# EAGLE design Control Board1 (EAGLE 6.5.0)
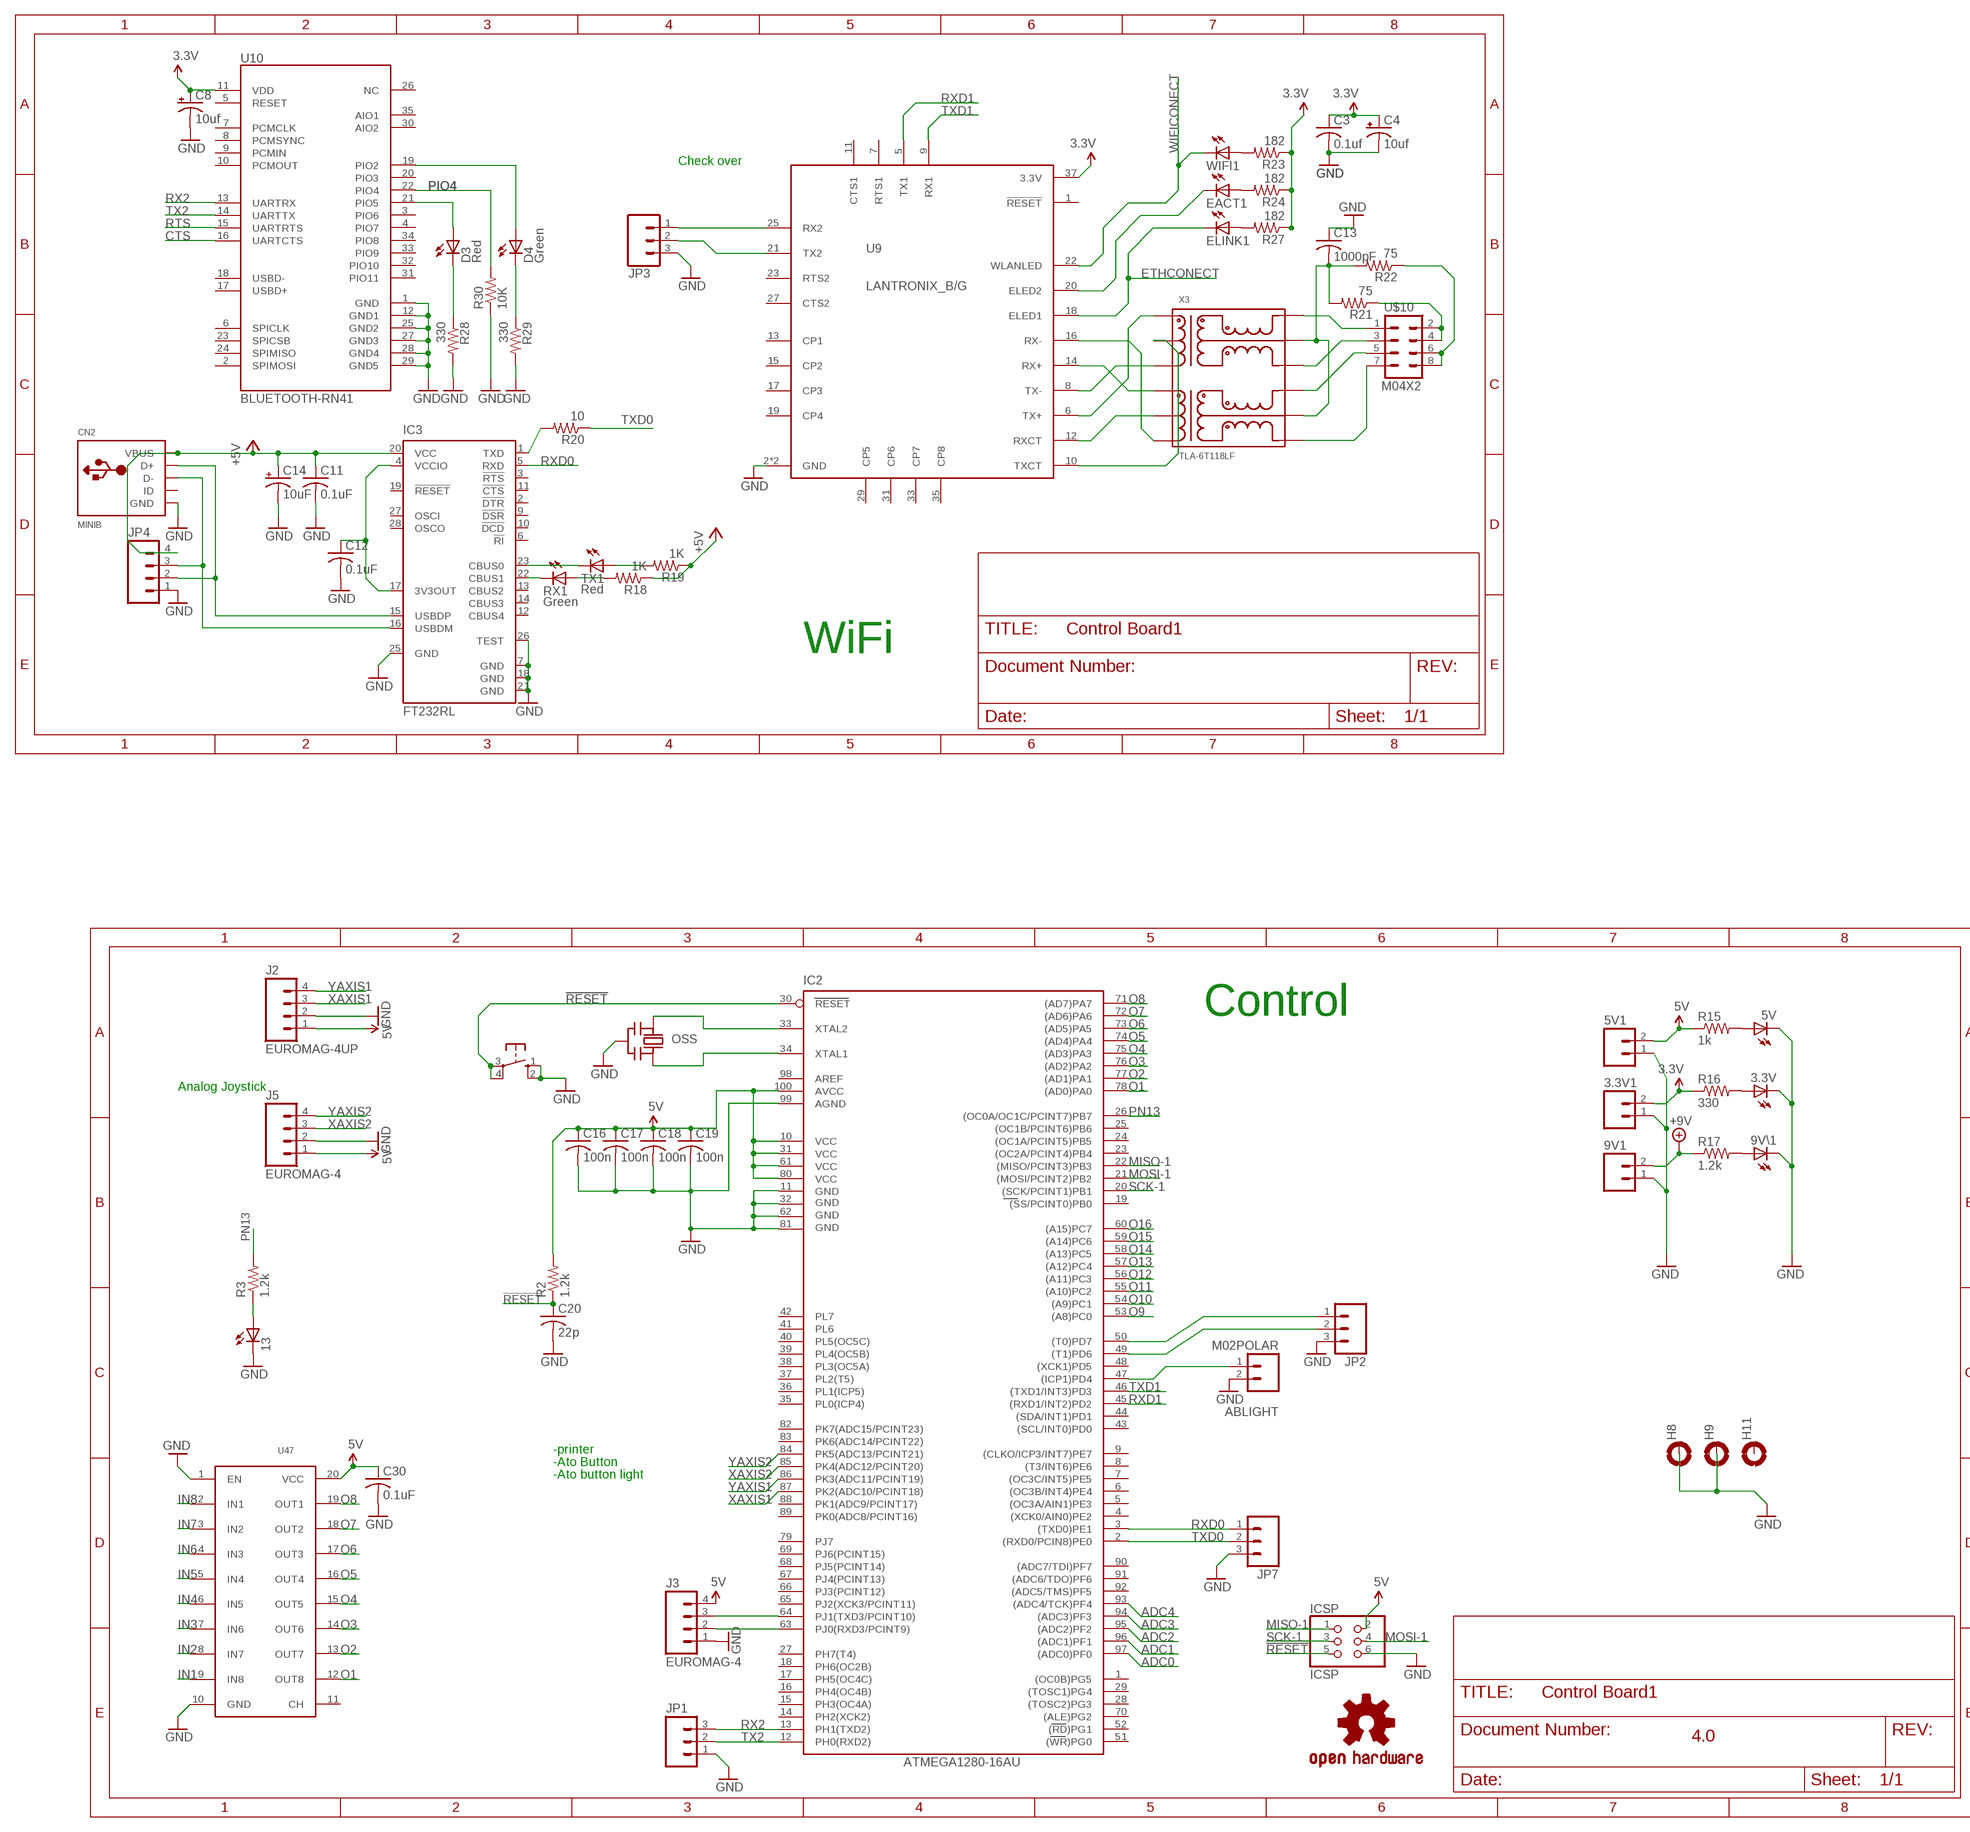
[diagram p0: schematic, sheet 1, part 1 of 2]
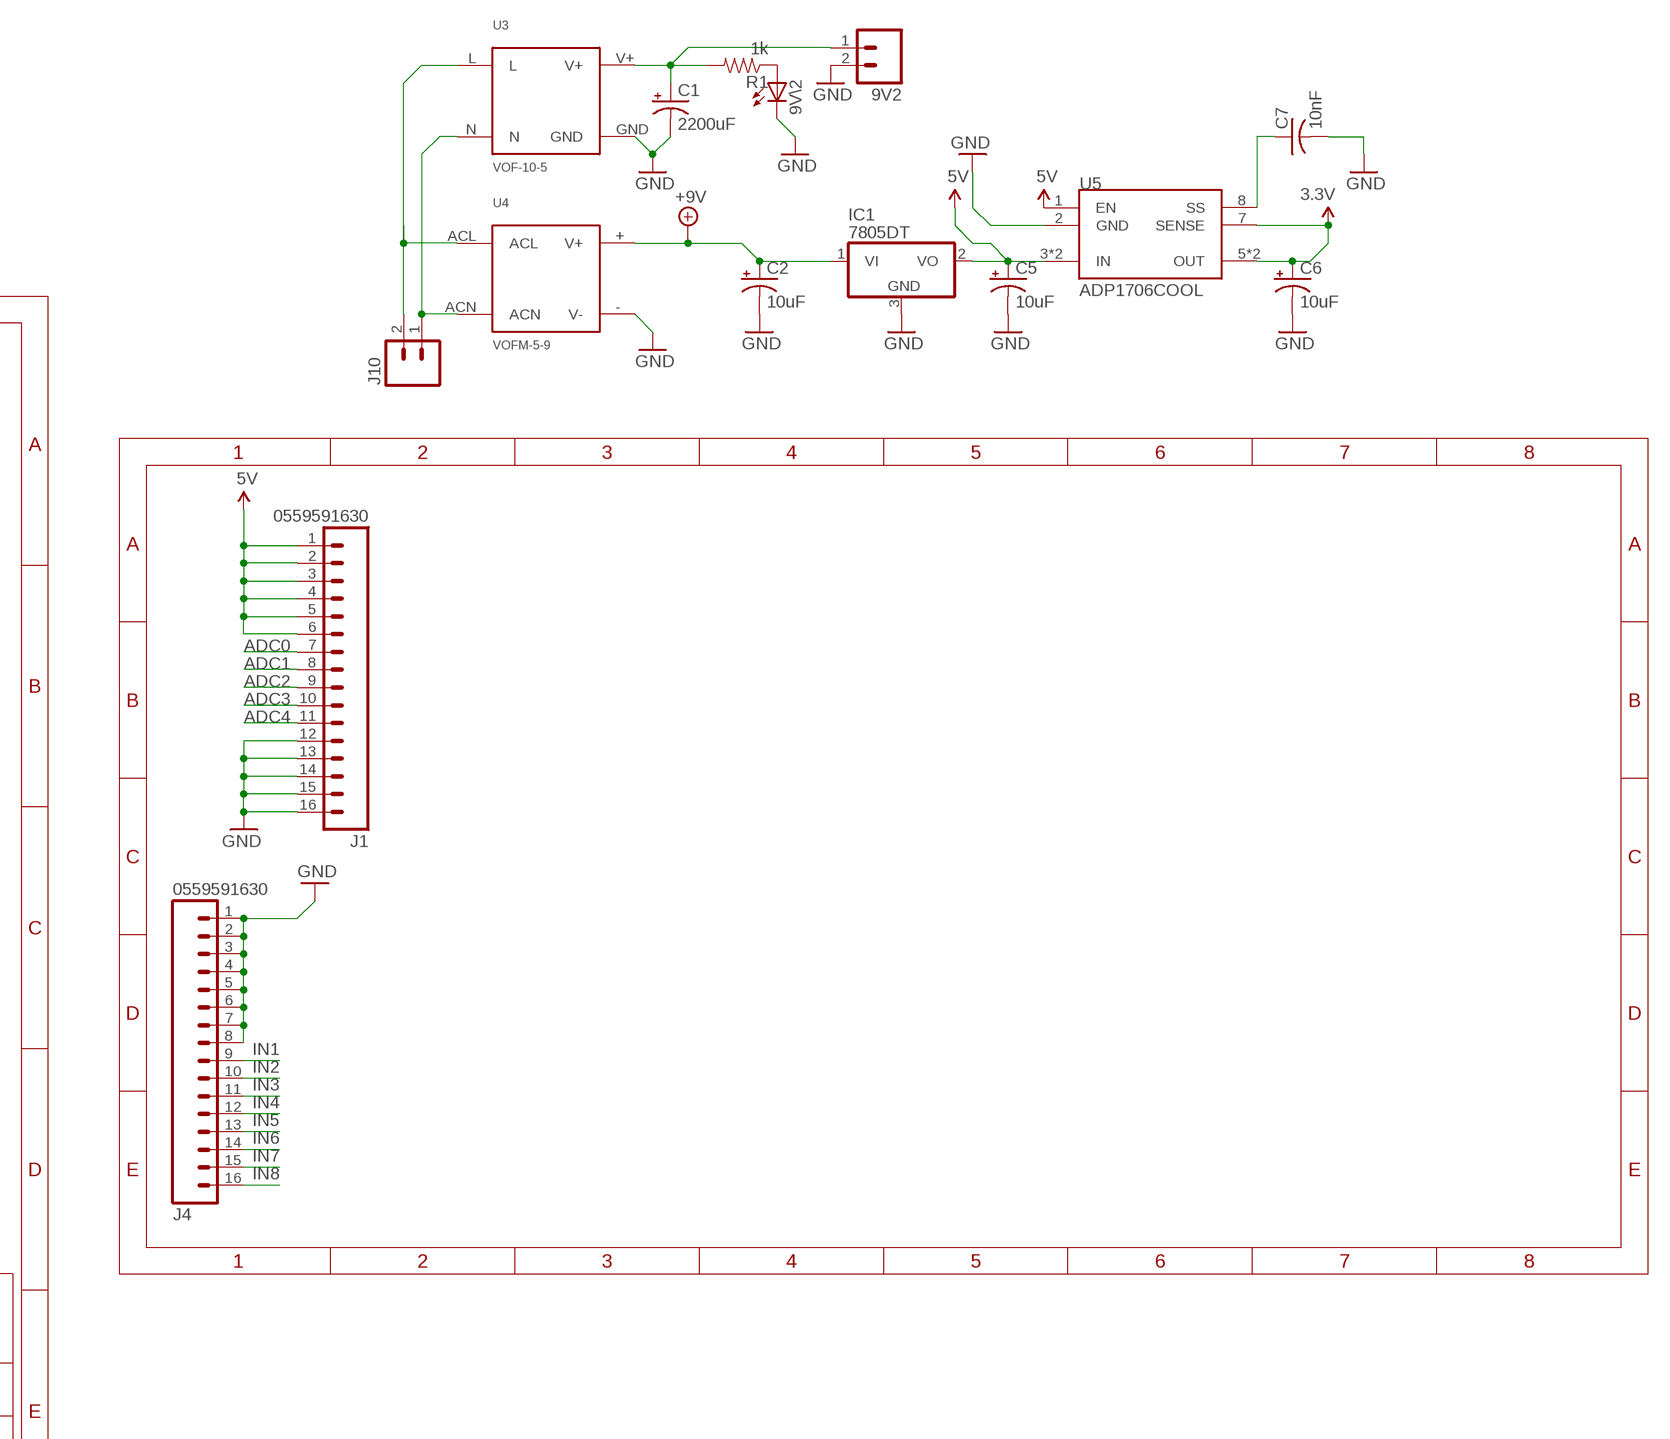
[diagram p1: schematic, sheet 1, part 2 of 2]

## Parts
3.3V  LED-FKIT-1206  [FKIT-LED-1206]
3.3V1  EUROMAG-290DEG  [M2]
5V  LED-FKIT-1206  [FKIT-LED-1206]
5V1  EUROMAG-290DEG  [M2]
9V1  EUROMAG-290DEG  [M2]
9V2  EUROMAG-290DEG  [M2]
9V\1  LED-FKIT-1206  [FKIT-LED-1206]
9V\2  LED-FKIT-1206  [FKIT-LED-1206]
13  LEDCHIP-LED0805  [CHIP-LED0805]
ABLIGHT  M02POLAR  [MOLEX-1X2]
C1  2200uF  CPOL-USE10-20  [EB20D]
C2  10uF  CPOL-USCT3528  [CT3528]
C3  0.1uf  C-USC0805K  [C0805K]
C4  10uf  CAP_POL3528  [EIA3528]
C5  10uF  CPOL-USCT3528  [CT3528]
C6  10uF  CPOL-USCT3528  [CT3528]
C7  10nF  C-USC0805  [C0805]
C8  10uf  CAP_POL3528  [EIA3528]
C11  0.1uF  C-USC0805K  [C0805K]
C12  0.1uF  C-USC0805K  [C0805K]
C13  1000pF  C-USC1812  [C1812]
C14  10uF  CAP_POL3528-KIT  [EIA3528-KIT]
C16  100n  C-USC0805  [C0805]
C17  100n  C-USC0805  [C0805]
C18  100n  C-USC0805  [C0805]
C19  100n  C-USC0805  [C0805]
C20  22p  C-USC0805  [C0805]
C30  0.1uF  C-USC0805  [C0805]
CN2  MINIB  USBMINIB  [USB-MINIB]
D3  Red  LEDCHIP-LED0805  [CHIP-LED0805]
D4  Green  LEDCHIP-LED0805  [CHIP-LED0805]
EACT1  LEDCHIP-LED0805  [CHIP-LED0805]
ELINK1  LEDCHIP-LED0805  [CHIP-LED0805]
H8  MOUNT-PAD-ROUND2.8  [2,8-PAD]
H9  MOUNT-PAD-ROUND2.8  [2,8-PAD]
H11  MOUNT-PAD-ROUND2.8  [2,8-PAD]
IC1  7805DT  [TO252]
IC2  ATMEGA1280-16AU  [TQFP100]
IC3  FT232RL  [SSOP28]
ICSP  ICSP  PINHD-2X3  [2X03]
J1  0559591630  [0559591630]
J2  EUROMAG-4UP  [M4-90]
J3  EUROMAG-4  [M4]
J4  0559591630  [0559591630]
J5  EUROMAG-4  [M4]
J10  EUROMAG-290DEG  [M2]
JP1  M03POLAR  [MOLEX-1X3]
JP2  M03POLAR  [MOLEX-1X3]
JP3  M03POLAR  [MOLEX-1X3]
JP4  M04LOCK  [1X04_LOCK]
JP7  M03LOCK  [1X03_LOCK]
OSS  CERMOSCILL-AWCSR  [AWCSR]
R1  1k  RESISTOR0805-RES  [0805]
R2  1.2k  RESISTOR0805-RES  [0805]
R3  1.2k  RESISTOR0805-RES  [0805]
R15  1k  RESISTOR0805-RES  [0805]
R16  330  RESISTOR0805-RES  [0805]
R17  1.2k  RESISTOR0805-RES  [0805]
R18  1K  R-US_R0805  [R0805@1]
R19  1K  R-US_R0805  [R0805@1]
R20  10  R-US_R0805  [R0805@1]
R21  75  R-US_R0805  [R0805@1]
R22  75  R-US_R0805  [R0805@1]
R23  182  R-US_R0805  [R0805@1]
R24  182  R-US_R0805  [R0805@1]
R27  182  R-US_R0805  [R0805@1]
R28  330  RESISTOR0805-RES  [0805]
R29  330  RESISTOR0805-RES  [0805]
R30  10K  RESISTOR0805-RES  [0805]
RX1  Green  LEDCHIP-LED0805  [CHIP-LED0805]
S1  10-XX  [B3F-10XX]
TX1  Red  LEDCHIP-LED0805  [CHIP-LED0805]
U3  VOF-10-5  VOF-10  [VOF-10]
U4  VOFM-5-9  VOFM-5  [VOFM-5]
U5  ADP1706COOL  [SO-8COOL]
U9  LANTRONIX_B/G  LANTRONIX_A/B  [LANA/BTH]
U10  BLUETOOTH-RN41  BLUETOOTH-RN41"  [RN41]
U47  MAX6818  [SSOP-20]
U$3  OSHW-LOGOL  [OSHW-LOGO-L]
U$10  M04X2  [2X4]
WIFI1  LEDCHIP-LED0805  [CHIP-LED0805]
X3  TLA-6T118LF  [SO-16MOD]

## Nets
3.3V: 3.3V1.2 C3.1 C4.A(+) C6.+ C8.A(+) R16.1 R23.1 R24.1 R27.1 U5.5(OUT) U5.6(OUT) U5.7(SENSE) U9.37(3.3V) U10.11(VDD)
5V: 5V1.2 C5.+ C16.1 C17.1 C18.1 C19.1 C30.1 IC1.2(VO) IC2.10(VCC) IC2.31(VCC1) IC2.61(VCC2) IC2.80(VCC3) IC2.100(AVCC) ICSP.2 J1.1 J1.2 J1.3 J1.4 J1.5 J1.6 J2.1 J3.4 J5.1 R2.2 R15.1 U5.1(EN) U5.3(IN) U5.4(IN) U47.20(VCC)
!RESET: C20.1 IC2.30(RESET) ICSP.5 R2.1 S1.3(P) S1.4(P1)
+5V: C11.1 C14.A(+) CN2.VBUS IC3.20(VCC) JP4.4 R18.1 R19.1
+9V: 9V1.2 C2.+ IC1.1(VI) R17.1 U4.+(V+)
ADC0: IC2.97((ADC0)PF0) J1.7
ADC1: IC2.96((ADC1)PF1) J1.8
ADC2: IC2.95((ADC2)PF2) J1.9
ADC3: IC2.94((ADC3)PF3) J1.10
ADC4: IC2.93((ADC4/TCK)PF4) J1.11
CTS: U10.16(UARTCTS)
D3: D3.C R28.1
D4: D4.C R29.1
ETHCONECT: ELINK1.C U9.18(ELED1)
GND: 3.3V1.1 3.3V.C 5V1.1 5V.C 9V1.1 9V2.2 9V\1.C 9V\2.C 13.C ABLIGHT.2 C1.- C2.- C3.2 C4.C(-) C5.- C6.- C7.2 C8.C(-) C11.2 C12.2 C13.1 C14.C(-) C16.2 C17.2 C18.2 C19.2 C20.2 C30.2 CN2.GND H8.B2,8(MOUNT) H9.B2,8(MOUNT) IC1.3(GND) IC2.11(GND) IC2.32(GND1) IC2.62(GND2) IC2.81(GND3) IC2.99(AGND) IC3.7(GND) IC3.18(GND) IC3.21(GND) IC3.25(GND) IC3.26(TEST) ICSP.6 J1.12 J1.13 J1.14 J1.15 J1.16 J2.2 J3.1 J4.1 J4.2 J4.3 J4.4 J4.5 J4.6 J4.7 J4.8 J5.2 JP1.1 JP2.3 JP3.3 JP4.1 JP7.3 OSS.2(GND) R28.2 R29.2 R30.1 S1.1(S) S1.2(S1) U3.GND U4.-(V-) U5.2(GND) U9.2(GND) U9.39(GND) U10.1(GND) U10.12(GND1) U10.25(GND2) U10.27(GND3) U10.28(GND4) U10.29(GND5) U47.1(EN) U47.10(GND)
IN1: J4.9 U47.9(IN8)
IN2: J4.10 U47.8(IN7)
IN3: J4.11 U47.7(IN6)
IN4: J4.12 U47.6(IN5)
IN5: J4.13 U47.5(IN4)
IN6: J4.14 U47.4(IN3)
IN7: J4.15 U47.3(IN2)
IN8: J4.16 U47.2(IN1)
MISO-1: IC2.22((MISO/PCINT3)PB3) ICSP.1
MOSI-1: IC2.21((MOSI/PCINT2)PB2) ICSP.4
N$1: C7.1 U5.8(SS)
N$2: 13.A R3.1
N$3: R21.1 U$10.2 U$10.4
N$4: R22.1 U$10.6 U$10.8
N$5: U$10.5 X3.11
N$6: IC2.34(XTAL1) OSS.3(OUT)
N$7: IC2.33(XTAL2) OSS.1(IN)
N$8: U$10.7 X3.9
N$9: 9V\2.A R1.1
N$10: IC2.63(PJ0(RXD3/PCINT9)) J3.2
N$11: IC2.64(PJ1(TXD3/PCINT10)) J3.3
N$12: ABLIGHT.1 IC2.47((ICP1)PD4)
N$13: IC2.50((T0)PD7) JP2.1
N$14: IC2.49((T1)PD6) JP2.2
N$15: JP3.1 U9.25(RX2)
N$16: JP3.2 U9.21(TX2)
N$22: 9V\1.A R17.2
N$23: 3.3V.A R16.2
N$24: 5V.A R15.2
N$25: J10.2 U3.L U4.ACL
N$27: J10.1 U3.N U4.ACN
N$28: 9V2.1 C1.+ R1.2 U3.V+
N$29: CN2.D+ IC3.15(USBDP) JP4.2
N$30: CN2.D- IC3.16(USBDM) JP4.3
N$31: IC3.23(CBUS0) TX1.C
N$32: IC3.22(CBUS1) RX1.C
N$33: R18.2 RX1.A
N$34: R19.2 TX1.A
N$35: IC3.1(TXD) R20.2
N$36: C12.1 IC3.4(VCCIO) IC3.17(3V3OUT)
N$37: U9.8(TX-) X3.3
N$38: U9.6(TX+) X3.1
N$39: U9.14(RX+) X3.6
N$42: U9.16(RX-) X3.8
N$44: U9.12(RXCT) X3.7
N$45: U9.10(TXCT) X3.2
N$50: U$10.3 X3.14
N$51: U$10.1 X3.16
N$52: C13.2 R21.2 R22.2 X3.10 X3.15
N$69: ELINK1.A R27.2
N$71: EACT1.A R24.2
N$72: R23.2 WIFI1.A
N$73: EACT1.C U9.20(ELED2)
N$74: D3.A U10.21(PIO5)
N$75: D4.A U10.19(PIO2)
O1: IC2.78((AD0)PA0) U47.12(OUT8)
O2: IC2.77((AD1)PA1) U47.13(OUT7)
O3: IC2.76((AD2)PA2) U47.14(OUT6)
O4: IC2.75((AD3)PA3) U47.15(OUT5)
O5: IC2.74((AD4)PA4) U47.16(OUT4)
O6: IC2.73((AD5)PA5) U47.17(OUT3)
O7: IC2.72((AD6)PA6) U47.18(OUT2)
O8: IC2.71((AD7)PA7) U47.19(OUT1)
O9: IC2.53((A8)PC0)
O10: IC2.54((A9)PC1)
O11: IC2.55((A10)PC2)
O12: IC2.56((A11)PC3)
O13: IC2.57((A12)PC4)
O14: IC2.58((A13)PC5)
O15: IC2.59((A14)PC6)
O16: IC2.60((A15)PC7)
PIO4: R30.2 U10.22(PIO4)
PN13: IC2.26((OC0A/OC1C/PCINT7)PB7) R3.2
RTS: U10.15(UARTRTS)
RX2: IC2.13(PH1(TXD2)) JP1.3 U10.13(UARTRX)
RXD0: IC2.3((TXD0)PE1) IC3.5(RXD) JP7.1
RXD1: IC2.45((RXD1/INT2)PD2) U9.5(TX1)
SCK-1: IC2.20((SCK/PCINT1)PB1) ICSP.3
TX2: IC2.12(PH0(RXD2)) JP1.2 U10.14(UARTTX)
TXD0: IC2.2((RXD0/PCIN8)PE0) JP7.2 R20.1
TXD1: IC2.46((TXD1/INT3)PD3) U9.9(RX1)
WIFICONECT: U9.22(WLANLED) WIFI1.C
XAXIS1: IC2.87(PK2(ADC10/PCINT18)) J2.3
XAXIS2: IC2.85(PK4(ADC12/PCINT20)) J5.3
YAXIS1: IC2.86(PK3(ADC11/PCINT19)) J2.4
YAXIS2: IC2.84(PK5(ADC13/PCINT21)) J5.4
Unconnected: CN2.ID H11.B2,8(MOUNT) IC2.1((OC0B)PG5) IC2.4((XCK0/AIN0)PE2) IC2.5((OC3A/AIN1)PE3) IC2.6((OC3B/INT4)PE4) IC2.7((OC3C/INT5)PE5) IC2.8((T3/INT6)PE6) IC2.9((CLKO/ICP3/INT7)PE7) IC2.14(PH2(XCK2)) IC2.15(PH3(OC4A)) IC2.16(PH4(OC4B)) IC2.17(PH5(OC4C)) IC2.18(PH6(OC2B)) IC2.19((SS/PCINT0)PB0) IC2.23((OC2A/PCINT4)PB4) IC2.24((OC1A/PCINT5)PB5) IC2.25((OC1B/PCINT6)PB6) IC2.27(PH7(T4)) IC2.28((TOSC2)PG3) IC2.29((TOSC1)PG4) IC2.35(PL0(ICP4)) IC2.36(PL1(ICP5)) IC2.37(PL2(T5)) IC2.38(PL3(OC5A)) IC2.39(PL4(OC5B)) IC2.40(PL5(OC5C)) IC2.41(PL6) IC2.42(PL7) IC2.43((SCL/INT0)PD0) IC2.44((SDA/INT1)PD1) IC2.48((XCK1)PD5) IC2.51((WR)PG0) IC2.52((RD)PG1) IC2.65(PJ2(XCK3/PCINT11)) IC2.66(PJ3(PCINT12)) IC2.67(PJ4(PCINT13)) IC2.68(PJ5(PCINT14)) IC2.69(PJ6(PCINT15)) IC2.70((ALE)PG2) IC2.79(PJ7) IC2.82(PK7(ADC15/PCINT23)) IC2.83(PK6(ADC14/PCINT22)) IC2.88(PK1(ADC9/PCINT17)) IC2.89(PK0(ADC8/PCINT16)) IC2.90((ADC7/TDI)PF7) IC2.91((ADC6/TDO)PF6) IC2.92((ADC5/TMS)PF5) IC2.98(AREF) IC3.2(!DTR) IC3.3(!RTS) IC3.6(!RI) IC3.9(!DSR) IC3.10(!DCD) IC3.11(!CTS) IC3.12(CBUS4) IC3.13(CBUS2) IC3.14(CBUS3) IC3.19(!RESET) IC3.27(OSCI) IC3.28(OSCO) U9.1(!RESET) U9.7(RTS1) U9.11(CTS1) U9.13(CP1) U9.15(CP2) U9.17(CP3) U9.19(CP4) U9.23(RTS2) U9.27(CTS2) U9.29(CP5) U9.31(CP6) U9.33(CP7) U9.35(CP8) U10.2(SPIMOSI) U10.3(PIO6) U10.4(PIO7) U10.5(RESET) U10.6(SPICLK) U10.7(PCMCLK) U10.8(PCMSYNC) U10.9(PCMIN) U10.10(PCMOUT) U10.17(USBD+) U10.18(USBD-) U10.20(PIO3) U10.23(SPICSB) U10.24(SPIMISO) U10.26(NC) U10.30(AIO2) U10.31(PIO11) U10.32(PIO10) U10.33(PIO9) U10.34(PIO8) U10.35(AIO1) U47.11(CH)

## Notes on the sheet
- Check over
- WiFi
- Control
- Analog Joystick
- -printer
- -Ato Button
- -Ato button light
- 4.0

## Library data of the parts
3.3V 5V 9V\1 9V\2 = SparkFun:LED: LEDs Standard schematic elements and footprints for 5mm, 3mm, 1206, and 0603 sized LEDs. 5mm - Spark Fun Electronics SKU : COM-00529 (and others)
3.3V1 5V1 9V1 9V2 J10 = NASA_LIB:EUROMAG-2
13 D3 D4 EACT1 ELINK1 RX1 TX1 WIFI1 = adafruit:LED: LED OSRAM: - CHIPLED LG R971, LG N971, LY N971, LG Q971, LY Q971, LO R971, LY R971 LH N974, LH R974 LS Q976, LO Q976, LY Q976 LO Q996 - Hyper CHIPLED LW Q18S LB Q993, LB Q99A, LB R99A - SideLED LS A670, LO A670, LY A670, LG A670, LP A670 LB A673, LV A673, LT A673, LW A673 LH A674 LY A675 LS A676, LA A676, LO A676, LY A676, LW A676 LS A679, LY A679, LG A679 - Hyper Micro SIDELED® LS Y876, LA Y876, LO Y876, LY Y876 LT Y87S - SmartLED LW L88C, LW L88S LB L89C, LB L89S, LG L890 LS L89K, LO L89K, LY L89K LS L896, LA L896, LO L896, LY L896 - TOPLED LS T670, LO T670, LY T670, LG T670, LP T670 LSG T670, LSP T670, LSY T670, LOP T670, LYG T670 LG T671, LOG T671, LSG T671 LB T673, LV T673, LT T673, LW T673 LH T674 LS T676, LA T676, LO T676, LY T676, LB T676, LH T676, LSB T676, LW T676 LB T67C, LV T67C, LT T67C, LS T67K, LO T67K, LY T67K, LW E67C LS E67B, LA E67B, LO E67B, LY E67B, LB E67C, LV E67C, LT E67C LW T67C LS T679, LY T679, LG T679 LS T770, LO T770, LY T770, LG T770, LP T770 LB T773, LV T773, LT T773, LW T773 LH T774 LS E675, LA E675, LY E675, LS T675 LS T776, LA T776, LO T776, LY T776, LB T776 LHGB T686 LT T68C, LB T68C - Hyper Mini TOPLED® LB M676 - Mini TOPLED Santana® LG M470 LS M47K, LO M47K, LY M47K Source: http://www.osram.convergy.de/
ABLIGHT = SparkFun-Connectors:M02: Standard 2-pin 0.1" header. Use with - straight break away headers ( PRT-00116) - right angle break away headers (PRT-00553) - swiss pins (PRT-00743) - machine pins (PRT-00117) - female headers (PRT-00115) Molex polarized connector foot print use with: PRT-08233 with associated crimp pins and housings. 2.54_SCREWTERM for use with PRT-10571. 3.5mm Screw Terminal footprints for PRT-08084 5mm Screw Terminal footprints for use with PRT-08433
C1 C2 C5 C6 = adafruit:CPOL-US: POLARIZED CAPACITOR, American symbol
C3 C7 C11-C13 C16-C20 C30 = adafruit:C-US: CAPACITOR, American symbol
C4 C8 C14 = SparkFun:CAP_POL: Capacitor Polarized These are standard SMD and PTH capacitors. Normally 10uF, 47uF, and 100uF in electrolytic and tantalum varieties. Always verify the external diameter of the through hole cap, it varies with capacity, voltage, and manufacturer. The EIA devices should be standard.
CN2 = adafruit:USB: USB Connectors USBMINIB - Surface Mount Female Mini-B USB Connector 4UConnector: 06564 By microbuilder.eu Thru-hole RA Female Mini-B USB Connector 4UConnector: 18732 By ladyada.net
H8 H9 H11 = holes:MOUNT-PAD-ROUND: MOUNTING PAD, round
IC1 = adafruit:78*: Positive VOLTAGE REGULATOR Added bigger pads to the TO-92 package
IC2 = atmel-2005:ATMEGA*: MICROCONTROLLER 64/128/256 Kbytes FLASH 4 Kbytes EEPROM 8 Kbytes SRAM 86 General Purpose I/O pins 12-channels16-bit PWM 4 x Serial USARTs 16-channels 10-bit A/D
IC3 = ftdichip:FT232R: Source: http://www.ftdichip.com/Documents/DataSheets/DS_FT232R_v104.pdf
ICSP = pinhead:PINHD-2X3: PIN HEADER
J1 J4 = NASA_LIB:0559591630
J2 J3 J5 = NASA_LIB:EUROMAG-4
JP1-JP3 JP7 = SparkFun:M03: Header 3 Standard 3-pin 0.1" header. Use with straight break away headers (SKU : PRT-00116), right angle break away headers (PRT-00553), swiss pins (PRT-00743), machine pins (PRT-00117), and female headers (PRT-00115). Molex polarized connector foot print use with SKU : PRT-08232 with associated crimp pins and housings.
JP4 = SparkFun:M04: Header 4 Standard 4-pin 0.1" header. Use with straight break away headers (SKU : PRT-00116), right angle break away headers (PRT-00553), swiss pins (PRT-00743), machine pins (PRT-00117), and female headers (PRT-00115). Molex polarized connector foot print use with SKU : PRT-08231 with associated crimp pins and housings. 1MM SMD Version SKU: PRT-10208
OSS = adafruit:CERMOSCILL: Ceramic oscillator with built in capacitors such as ZTT-12MHz http://www.ladyada.net/library/eagle
R1-R3 R15-R17 R28-R30 = SparkFun:RESISTOR: Resistor Basic schematic elements and footprints for 0603, 1206, and PTH resistors.
R18-R24 R27 = adafruit:R-US_: RESISTOR, American symbol
S1 = switch-omron:10-XX: OMRON SWITCH
U3 = NASA_LIB:VOF-10
U4 = NASA_LIB:VOFM-5
U5 = NASA_LIB:ADP1706
U9 = NASA_LIB:LANTRONIX_A/B
U10 = ScratchPad:BLUETOOTH-RN41
U47 = RJ's parts:MAX6818
U$3 = SparkFun:OSHW-LOGO: Open Source Hardware Logo This logo indicates the piece of hardware it is found on incorporates a OSHW license and/or adheres to the definition of open source hardware found here: http://freedomdefined.org/OSHW
U$10 = SparkFun:M04X2
X3 = NASA_LIB:TLA-6T118LF

## Net classes
1 power: width 0.61 mm, drill 0.711 mm, clearance 0.203 mm

## Board
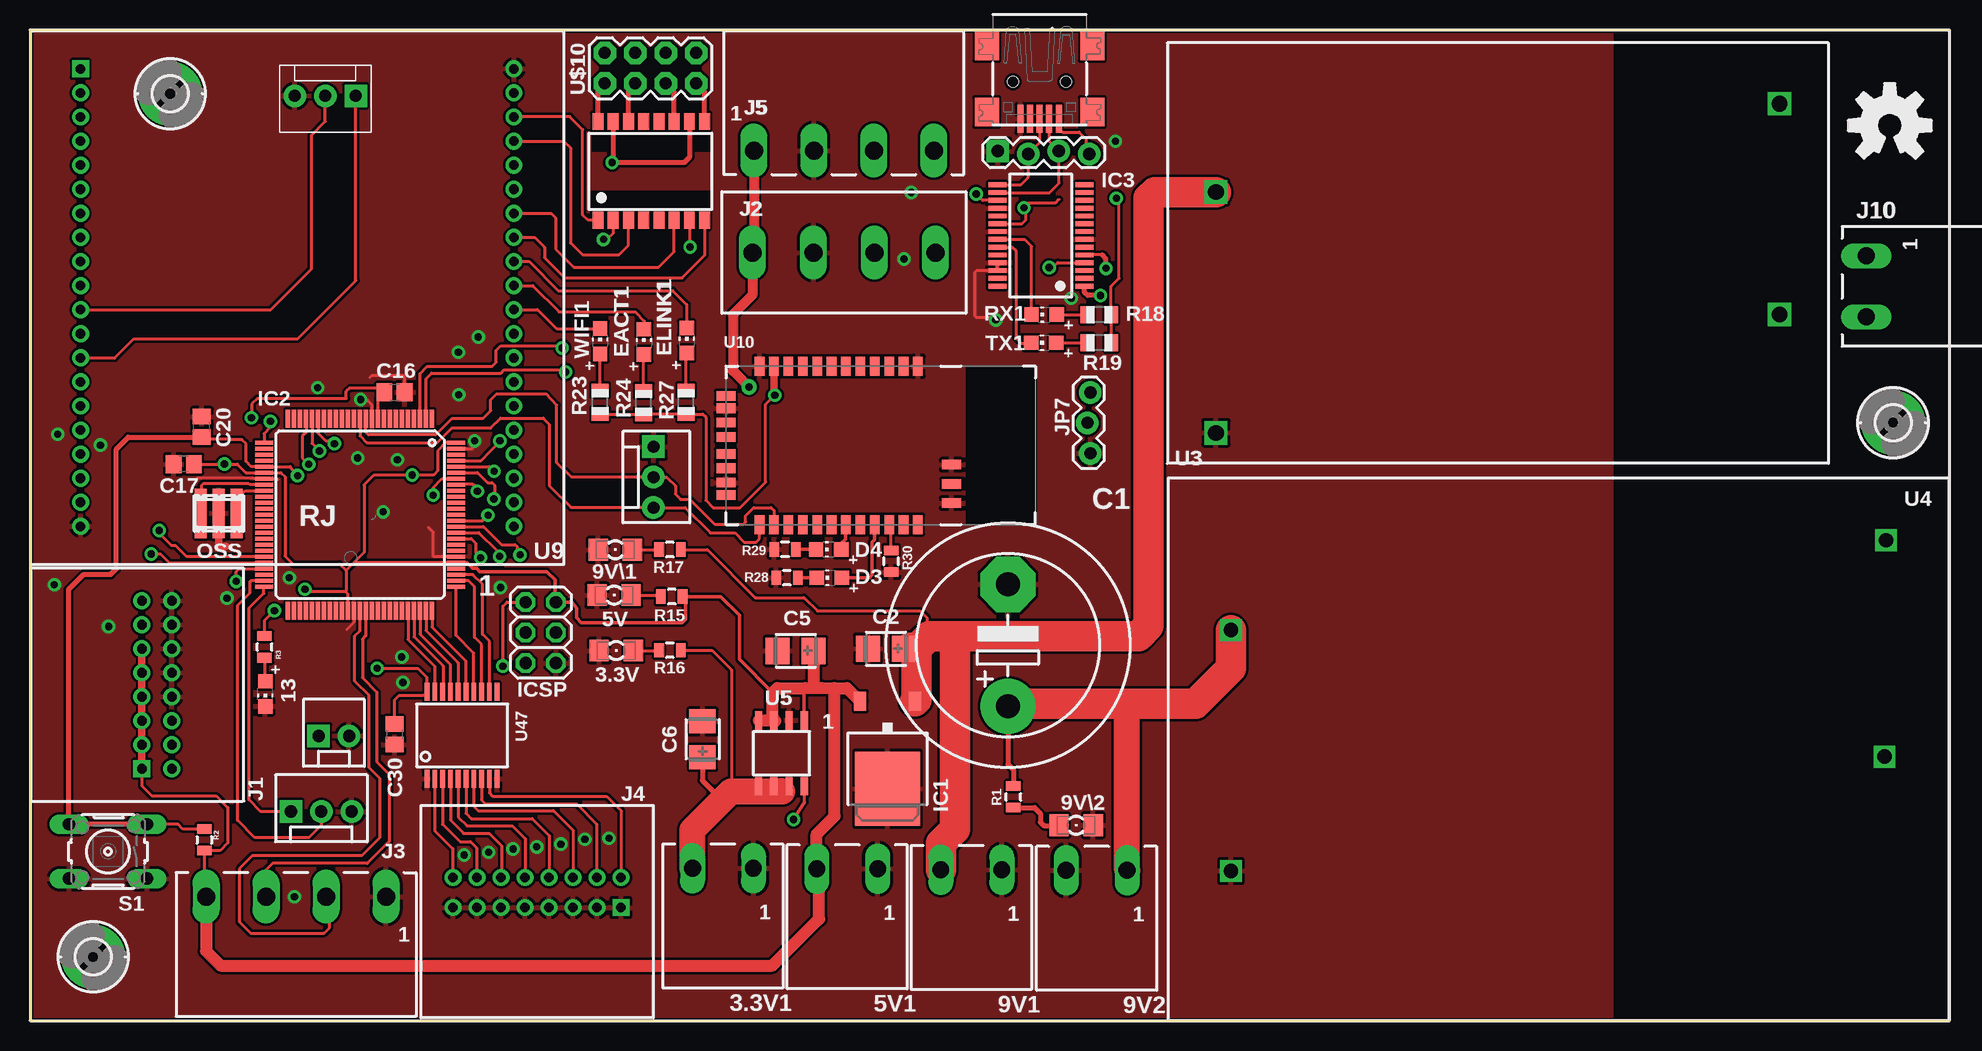
[diagram p2: board, top side]
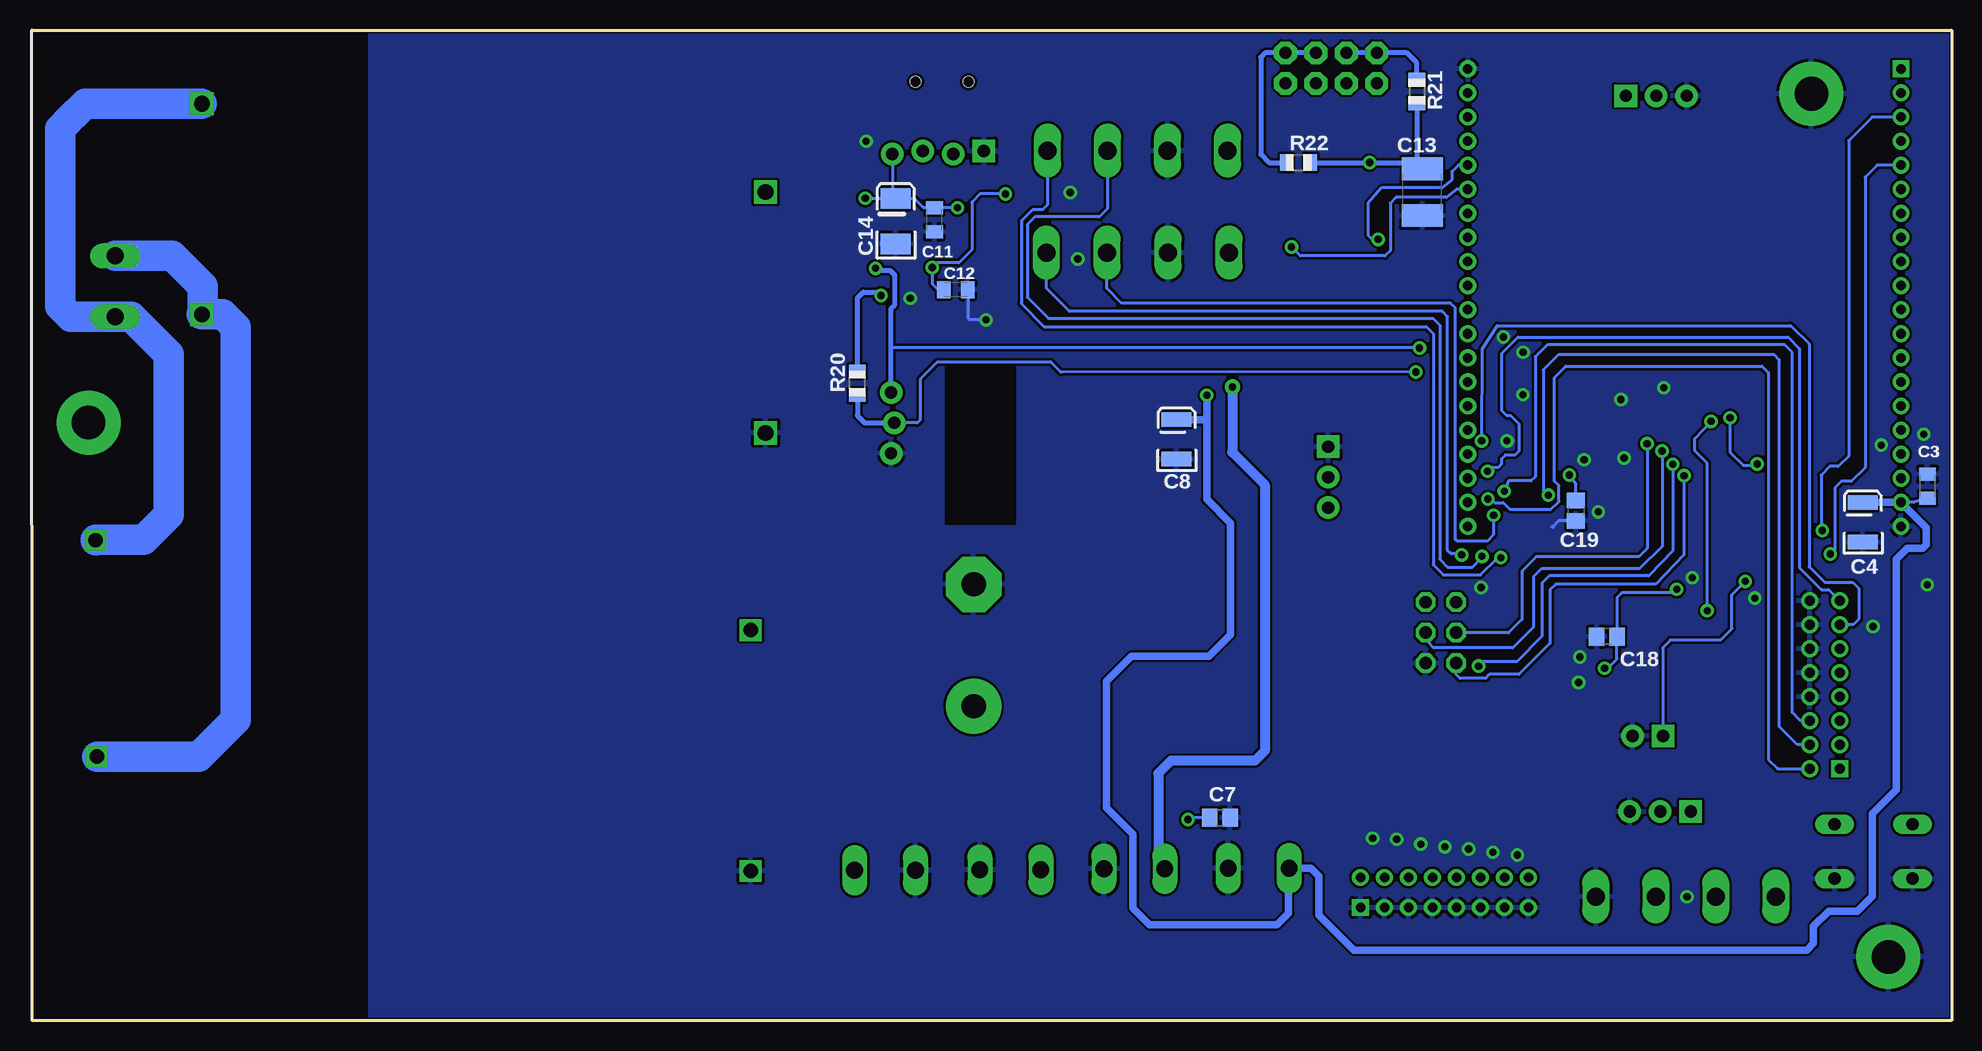
[diagram p3: board, bottom side, seen from below]

Size 160.02 x 82.55 mm. Coordinates in mm from the lower left corner, seen from the top.
Outline: 0,0 160,0 160.02,82.55 0,82.55 0,0
Copper layers (1*16): Top 0.035mm / dielectric 1.5mm / Bottom 0.035mm
Design rules "default": minimum track width 8mil, minimum drill 20mil, track to track 8mil, track to pad 8mil, pad to pad 8mil, via to via 8mil, smd to smd 8mil, copper to edge 10mil, drill to drill 8mil, minimum pad ring 12mil, minimum via ring 10mil, stop-mask expansion 4mil, vias tented up to drill 25mil, thermal gap 10mil
tRestrict: area 78,41.3 to 83.9,54.6
bRestrict: area 78,41.3 to 83.9,54.6

### Footprints (pad centres in the part's own frame; a part is rotated, then mirrored left to right if it is on the bottom)
FKIT-LED-1206 = smd 1.6 x 1.803: A -1.422,0; C 1.422,0
M2 = drill 1.4 long: 1 -2.54,0; 2 2.54,0
CHIP-LED0805 = smd 1.2 x 1.2: A 0,-1.05; C 0,1.05
MOLEX-1X2 = drill 1.016 pad 1.88 square: 1 0,0 | drill 1.016 pad 1.88: 2 2.54,0
EB20D = drill 2.007 pad 4.597: + -5.08,0 | drill 2.007 pad 4.597 octagon: - 5.08,0
CT3528 = smd 2 x 2.2: + 1.5,0; - -1.5,0
C0805K = smd 1.1 x 1.4: 1 -1,0; 2 1,0
EIA3528 = smd 1.2 x 2.5: A 1.65,0; C -1.65,0
C0805 = smd 1.3 x 1.5: 1 -0.85,0; 2 0.85,0
C1812 = smd 1.9 x 3.4: 1 -1.95,0; 2 1.95,0
EIA3528-KIT = smd 1.7 x 2.5: A 1.9,0; C -1.9,0
USB-MINIB = smd 0.5 x 2.308: D+ 0,4.064; D- -0.8,4.064; GND 1.6,4.064; ID 0.8,4.064; VBUS -1.6,4.064 | smd 2 x 2.4: GND1 -4.4,-2; GND2 -4.4,3.5; GND3 4.4,3.5; GND4 4.4,-2 | hole 0.9: -2.2,1; 2.2,1
2,8-PAD = drill 2.8 pad 5.334: B2,8 0,0
TO252 = smd 1 x 1.6: 1 -2.28,-4.8; 2 2.28,-4.8 | smd 5.4 x 6.2: 3 0,2.5
TQFP100 = smd 1.5 x 0.35: 1 -8,6; 2 -8,5.5; 3 -8,5; 4 -8,4.5; 5 -8,4; 6 -8,3.5; 7 -8,3; 8 -8,2.5; 9 -8,2; 10 -8,1.5; 11 -8,1; 12 -8,0.5; 13 -8,0; 14 -8,-0.5; 15 -8,-1; 16 -8,-1.5; 17 -8,-2; 18 -8,-2.5; 19 -8,-3; 20 -8,-3.5; 21 -8,-4; 22 -8,-4.5; 23 -8,-5; 24 -8,-5.5; 25 -8,-6; 51 8,-6; 52 8,-5.5; 53 8,-5; 54 8,-4.5; 55 8,-4; 56 8,-3.5; 57 8,-3; 58 8,-2.5; 59 8,-2; 60 8,-1.5; 61 8,-1; 62 8,-0.5; 63 8,0; 64 8,0.5; 65 8,1; 66 8,1.5; 67 8,2; 68 8,2.5; 69 8,3; 70 8,3.5; 71 8,4; 72 8,4.5; 73 8,5; 74 8,5.5; 75 8,6 | smd 0.35 x 1.5: 26 -6,-8; 27 -5.5,-8; 28 -5,-8; 29 -4.5,-8; 30 -4,-8; 31 -3.5,-8; 32 -3,-8; 33 -2.5,-8; 34 -2,-8; 35 -1.5,-8; 36 -1,-8; 37 -0.5,-8; 38 0,-8; 39 0.5,-8; 40 1,-8; 41 1.5,-8; 42 2,-8; 43 2.5,-8; 44 3,-8; 45 3.5,-8; 46 4,-8; 47 4.5,-8; 48 5,-8; 49 5.5,-8; 50 6,-8; 76 6,8; 77 5.5,8; 78 5,8; 79 4.5,8; 80 4,8; 81 3.5,8; 82 3,8; 83 2.5,8; 84 2,8; 85 1.5,8; 86 1,8; 87 0.5,8; 88 0,8; 89 -0.5,8; 90 -1,8; 91 -1.5,8; 92 -2,8; 93 -2.5,8; 94 -3,8; 95 -3.5,8; 96 -4,8; 97 -4.5,8; 98 -5,8; 99 -5.5,8; 100 -6,8
SSOP28 = smd 0.4 x 1.5: 1 -4.225,-3.625; 2 -3.575,-3.625; 3 -2.925,-3.625; 4 -2.275,-3.625; 5 -1.625,-3.625; 6 -0.975,-3.625; 7 -0.325,-3.625; 8 0.325,-3.625; 9 0.975,-3.625; 10 1.625,-3.625; 11 2.275,-3.625; 12 2.925,-3.625; 13 3.575,-3.625; 14 4.225,-3.625; 15 4.225,3.625; 16 3.575,3.625; 17 2.925,3.625; 18 2.275,3.625; 19 1.625,3.625; 20 0.975,3.625; 21 0.325,3.625; 22 -0.325,3.625; 23 -0.975,3.625; 24 -1.625,3.625; 25 -2.275,3.625; 26 -2.925,3.625; 27 -3.575,3.625; 28 -4.225,3.625
2X03 = drill 1.016 octagon: 1 -2.54,-1.27; 2 -2.54,1.27; 3 0,-1.27; 4 0,1.27; 5 2.54,-1.27; 6 2.54,1.27
0559591630 = drill 0.8 square: 1 -7,0 | drill 0.8: 2 -5,0; 3 -3,0; 4 -1,0; 5 1,0; 6 3,0; 7 5,0; 8 7,0; 9 -7,-2.5; 10 -5,-2.5; 11 -3,-2.5; 12 -1,-2.5; 13 1,-2.5; 14 3,-2.5; 15 5,-2.5; 16 7,-2.5
M4-90 = drill 1.5 long: 1 0,0; 2 5.08,0; 3 10.16,0; 4 15.24,0
M4 = drill 1.5 long: 1 0,0; 2 5,0; 3 10,0; 4 15,0
MOLEX-1X3 = drill 1.016 pad 1.88 square: 1 0,0 | drill 1.016 pad 1.88: 2 2.54,0; 3 5.08,0
1X04_LOCK = drill 1.016 pad 1.88 square: 1 0,0.127 | drill 1.016 pad 1.88: 2 2.54,-0.127; 3 5.08,0.127; 4 7.62,-0.127
1X03_LOCK = drill 1.016 pad 1.88: 1 0,0.127; 2 2.54,-0.127; 3 5.08,0.127
AWCSR = smd 1 x 4.1: 1 -1.5,0; 2 0,0; 3 1.5,0
0805 = smd 0.8 x 1.2: 1 -0.9,0; 2 0.9,0
R0805@1 = smd 1.1 x 1.4: 1 -1,0; 2 1,0
B3F-10XX = drill 1.016 long: 1 -3.251,2.261; 2 3.251,2.261; 3 -3.251,-2.261; 4 3.251,-2.261
VOF-10 = drill 1.2 square: GND 5.207,12.446; L 59.817,40.005; N 59.69,21.971; V+ 5.207,32.512
VOFM-5 = drill 1.3 square: + 51.054,12.446; - 51.054,32.512; ACL 4.064,5.08; ACN 4.064,22.631
SO-8COOL = smd 0.61 x 1.524: 1 -1.905,-2.743; 2 -0.635,-2.743; 3 0.635,-2.743; 4 1.905,-2.743; 5 1.905,2.743; 6 0.635,2.743; 7 -0.635,2.743; 8 -1.905,2.743
LANA/BTH = drill 0.8 square: 1 -18.059,19.063 | drill 0.8: 2 18.059,19.063; 3 -18.059,17.056; 4 18.059,17.056; 5 -18.059,15.05; 6 18.059,15.05; 7 -18.059,13.043; 8 18.059,13.043; 9 -18.059,11.036; 10 18.059,11.036; 11 -18.059,9.03; 12 18.059,9.03; 13 -18.059,7.023; 14 18.059,7.023; 15 -18.059,5.016; 16 18.059,5.016; 17 -18.059,3.01; 18 18.059,3.01; 19 -18.059,1.003; 20 18.059,1.003; 21 -18.059,-1.003; 22 18.059,-1.003; 23 -18.059,-3.01; 24 18.059,-3.01; 25 -18.059,-5.016; 26 18.059,-5.016; 27 -18.059,-7.023; 28 18.059,-7.023; 29 -18.059,-9.03; 30 18.059,-9.03; 31 -18.059,-11.036; 32 18.059,-11.036; 33 -18.059,-13.043; 34 18.059,-13.043; 35 -18.059,-15.05; 36 18.059,-15.05; 37 -18.059,-17.056; 38 18.059,-17.056; 39 -18.059,-19.063; 40 18.059,-19.063
RN41 = smd 0.8 x 1.6: 1 -6.6,-6.6; 2 -5.4,-6.6; 3 -4.2,-6.6; 4 -3,-6.6; 5 -1.8,-6.6; 6 -0.6,-6.6; 7 0.6,-6.6; 8 1.8,-6.6; 9 3,-6.6; 10 4.2,-6.6; 11 5.4,-6.6; 12 6.6,-6.6; 13 6.6,6.6; 14 5.4,6.6; 15 4.2,6.6; 16 3,6.6; 17 1.8,6.6; 18 0.6,6.6; 19 -0.6,6.6; 20 -1.8,6.6; 21 -3,6.6; 22 -4.2,6.6; 23 -5.4,6.6; 24 -6.6,6.6 | smd 1.6 x 0.8: 25 -9.4,4.8; 26 -9.4,3.2; 27 -9.4,1.6; 28 9.4,3.1; 29 9.4,-3.1; 30 9.4,-4.122; 31 9.4,-1.9; 32 9.4,-0.7; 33 9.4,0.7; 34 9.4,1.9; 35 9.4,4.122
SSOP-20 = smd 0.4 x 1.5: 1 -2.925,-3.625; 2 -2.275,-3.625; 3 -1.625,-3.625; 4 -0.975,-3.625; 5 -0.325,-3.625; 6 0.325,-3.625; 7 0.975,-3.625; 8 1.625,-3.625; 9 2.275,-3.625; 10 2.925,-3.625; 11 2.925,3.625; 12 2.275,3.625; 13 1.625,3.625; 14 0.975,3.625; 15 0.325,3.625; 16 -0.325,3.625; 17 -0.975,3.625; 18 -1.625,3.625; 19 -2.275,3.625; 20 -2.925,3.625
2X4 = drill 1.016 pad 1.88 octagon: 1 -3.81,-1.27; 2 -3.81,1.27; 3 -1.27,-1.27; 4 -1.27,1.27; 5 1.27,-1.27; 6 1.27,1.27; 7 3.81,-1.27; 8 3.81,1.27
SO-16MOD = smd 1.4 x 0.9: 1 -4.11,4.445; 2 -4.11,3.175; 3 -4.11,1.905; 4 -4.11,0.635; 5 -4.11,-0.635; 6 -4.11,-1.905; 7 -4.11,-3.175; 8 -4.11,-4.445; 9 4.11,-4.445; 10 4.11,-3.175; 11 4.11,-1.905; 12 4.11,-0.635; 13 4.11,0.635; 14 4.11,1.905; 15 4.11,3.175; 16 4.11,4.445

### Placement (x,y rotation side)
3.3V  48.87,30.84 180 top
3.3V1  57.76,12.7 180 top
5V  48.69,35.46 180 top
5V1  68.12,12.65 180 top
9V1  78.46,12.57 180 top
9V2  88.9,12.52 180 top
9V\1  48.79,39.24 180 top
9V\2  87.2,16.28 0 top
13  19.61,27.23 180 top
ABLIGHT  24.05,23.72 0 top
C1  81.51,31.27 90 top
C2  71.35,30.99 0 top
C3  2.01,44.53 90 bottom
C4  7.39,41.53 90 bottom
C5  63.83,30.81 0 top
C6  56.06,23.44 270 top
C7  60.99,16.92 0 bottom
C8  64.59,48.44 90 bottom
C11  84.79,66.73 270 bottom
C12  83.01,60.91 0 bottom
C13  44.12,69.04 90 bottom
C14  88.01,66.62 90 bottom
C16  30.38,52.35 0 top
C17  12.83,46.38 180 top
C18  28.73,32 180 bottom
C19  31.32,42.49 270 bottom
C20  14.33,49.48 90 top
C30  30.38,23.85 270 top
CN2  84.15,79.22 180 top
D3  66.62,36.91 90 top
D4  66.57,39.27 90 top
EACT1  51.18,56.57 0 top
ELINK1  54.74,56.67 0 top
H8  11.68,77.24 90 top
H9  5.26,5.31 90 top
H11  155.3,49.83 90 top
IC1  71.48,21.82 180 top
IC2  27.51,42.16 270 top
IC3  84.25,65.43 90 top
ICSP  42.57,32.33 270 top
J1  9.32,27.99 90 top
J2  60.22,64.01 0 top
J3  29.67,10.34 180 top
J4  42.27,9.42 180 top
J5  60.35,72.49 0 top
J10  153.06,61.19 270 top
JP1  51.97,47.83 270 top
JP2  21.74,17.42 0 top
JP3  27.15,77.06 180 top
JP4  80.67,72.34 0 top
JP7  88.27,52.35 270 top
OSS  15.75,42.27 0 top
R1  81.97,18.64 90 top
R2  14.53,15.06 270 top
R3  19.56,31.14 90 top
R15  53.49,35.33 180 top
R16  53.34,30.86 180 top
R17  53.34,39.24 180 top
R18  89.13,58.83 180 top
R19  89.13,56.49 180 top
R20  91.21,53.11 90 bottom
R21  44.58,77.42 270 bottom
R22  54.43,71.5 0 bottom
R23  47.52,51.54 90 top
R24  51.16,51.49 90 top
R27  54.69,51.54 90 top
R28  63.09,36.91 180 top
R29  62.94,39.27 180 top
R30  71.78,38.28 90 top
RX1  84.53,58.83 90 top
S1  6.5,14.1 180 top
TX1  84.51,56.49 90 top
U3  94.89,0.03 0 top
U4  149.91,81.48 180 top
U5  62.64,22.28 180 top
U9  22.28,60.25 0 top
U10  67.41,47.93 180 top
U47  36.02,23.77 0 top
U$3  155.02,74.6 0 top
U$10  51.71,79.38 0 top
WIFI1  47.52,56.62 0 top
X3  51.79,70.82 90 top

### Tracks (layer width: path | path; a pad name or v marks a point on that pad's centre or on a via)
3.3V  (via drill 0.6)
  Top 0.254: R23.1 47.57,50.49 R24.1 51.27,50.6 51.46,50.6 51.52,50.54 R27.1 56.07,50.54 56.34,50.27 56.34,43.36 56.95,42.75 59.18,42.75 61.32,44.88 61.32,51.36 v62.08,52.12 | 58.67,19.1 58.47,19.3 58.47,29.23 56.84,30.86 R16.1
  Top 0.406: 61.47,19.1 61.34,19.23 U5.5 59.82,19.48 59.79,19.46 | U5.6 62.61,19.2 62.71,19.1 | U5.7 62.97,19.51 62.61,19.15 | C6.+ 56.06,19.99 57.68,18.36
  Top 0.61: U10.11 62.01,52.19 v62.08,52.12
  Top 2.184: 62.61,19.15 62.69,19.07 62.71,19.1 61.47,19.1 58.67,19.1 58.42,19.1 57.68,18.36 55.22,15.9 3.3V1.2
  Bottom 0.254: C3.1 3.15,43.19 U9.37
  Bottom 0.61: v62.08,52.12 62.08,50.22 | 62.08,50.22 62.08,43.43 60.1,41.45 60.1,32.16 61.9,30.35 68.38,30.35 70.46,28.27 70.46,17.75 68.22,15.52 68.22,9.35 66.88,8 56.24,8 55.27,8.97 55.27,12.65 3.3V1.2 53.39,12.7 52.73,12.04 52.73,8.79 49.81,5.87 12.06,5.87 11.51,6.43 11.51,7.85 10.24,9.12 7.85,9.12 6.6,10.36 6.6,17.25 4.62,19.23 4.62,38.43 3.68,39.37 2.41,39.37 2.11,39.67 2.11,41.08 U9.37 7.38,43.19 C4.A | C8.A 62.21,50.09 62.08,50.22
5V  (via drill 0.6, 0.6 pad 1.27)
  Top 0.254: IC2.61 26.51,35.54 26.31,35.74 26.24,35.74 | 26.24,35.74 23.11,35.74 v22.91,35.94 | IC2.80 26.99,38.16 | 26.99,38.16 26.34,37.52 | 26.34,37.52 26.34,35.84 26.24,35.74 | 26.34,37.52 25.81,38.05 21.92,38.05 21.26,38.71 21.26,45.31 20.91,45.66 IC2.31 17.98,45.67 17.27,46.38 v16.2,46.38 C17.1 | IC2.100 34.6,48.16 33.98,47.47 33.98,45.82 33.63,45.47 v31.85,45.47 28.65,45.47 27.84,44.65 27.84,39.01 26.99,38.16 | 29.46,52.25 29.01,51.79 IC2.10 29.01,51.83 C16.1 29.15,52.73 26.67,52.73 26.36,52.43 26.36,51.84 18.95,51.84 18.49,51.38 18.49,50.27 v18.47,50.24 | J3.4 14.53,10.48 R2.2 14.54,14.17 15.85,14.17 16.48,14.81 16.48,17.75 15.52,18.72 10.16,18.72 9.32,19.56 J1.1 | C30.1 30.38,26.72 30.76,27.1 32.8,27.1 U47.20 33.09,28.58 32.36,29.31 28.98,29.31 v28.93,29.36
  Top 0.305: U5.1 64.54,27.61 64.64,27.71 | 61.9,27.33 59.13,30.1 59.13,33.78 57.58,35.33 R15.1 54.63,35.09 54.63,33.45 54.36,33.17 45.92,33.17 45.54,33.55 45.54,34.37 45.19,34.87 ICSP.2 43.76,34.95 43.76,36.73 43.08,37.41 37.49,37.41 37.21,37.69 36.91,37.69 36.44,38.16 IC2.80
  Top 0.61: J1.6 J1.5 J1.4 J1.3 J1.2 J1.1
  Top 0.813: J5.1 60.35,64.14 J2.1 60.22,60.48 58.6,58.85 58.6,54.15 v59.94,52.81
  Top 1.016: J3.4 14.67,5.78 15.88,4.57 61.87,4.57 65.79,8.48 65.79,13.01 65.58,13.21 | 65.58,13.21 5V1.2 | U5.4 U5.3 62.13,24.97 61.9,25.2 61.9,27.33 62.28,27.71 64.64,27.71 65.99,27.74 | 65.99,27.74 67.03,27.71 | 67.03,27.71 68.1,27.71 IC1.2 | 65.58,13.21 65.58,15.54 67.08,17.04 67.08,27.66 67.03,27.71 | C5.+ 65.33,27.73 65.99,27.74
  Bottom 0.254: v22.91,35.94 22.94,35.94 23.22,35.66 27.48,35.66 27.89,35.26 27.89,32.02 C18.1 27.89,30.12 28.65,29.36 v28.93,29.36 | C19.1 31.32,44.7 v31.85,45.47 | v18.47,50.24 18.47,47.37 17.37,46.28 16.28,46.28 v16.2,46.38
  Bottom 0.813: v59.94,52.81 59.94,47.35 57.25,44.65 57.25,22.48 58.06,21.67 65.05,21.67 66.12,20.6 66.12,13.18 5V1.2
!RESET  (via drill 0.6)
  Top 0.254: C20.1 14.5,48.45 16.51,48.45 16.55,48.41 17.65,48.41 18.01,48.06 18.01,46.61 18.45,46.16 IC2.30 21.7,46.16 v22.3,45.41 | R2.1 12.74,15.96 12.34,16.36 S1.3
  Top 0.406: S1.4 S1.3 3.5,16.36 3.23,16.64 3.23,35.94 4.47,37.19 6.73,37.19 7.19,37.64 7.19,47.62 8.18,48.62 14.31,48.62 C20.1
  Bottom 0.254: v22.3,45.41 22.3,38.81 24.66,36.37 32.99,36.37 33.48,35.89 33.48,31.45 36.07,28.85 38.51,28.85 38.84,28.52 40.97,28.52 41.33,28.88 41.33,29.77 ICSP.5
+5V  (via drill 0.6)
  Top 0.254: R19.1 90.13,58.43 90.42,58.73 90.42,58.9 90.12,59.21 | 90.12,59.21 90.12,58.84 R18.1 | IC3.20 82.69,66.41 83.01,66.73 83.01,67.59 v82.86,67.74 83.24,68.12 85.47,68.12 85.78,68.43 | 90.12,59.21 90.12,61.19 90.78,61.85 90.78,68.3 v90.55,68.53 | CN2.VBUS 85.75,74.37 86.08,74.04 87.45,74.04 88.04,73.46 88.04,72.47 JP4.4
  Bottom 0.254: v82.86,67.74 84.77,67.74 C11.1 85.68,67.73 86.46,68.5 87.99,68.5 C14.A | v90.55,68.53 C14.A | JP4.4 88.29,68.71 88.24,68.66 88.14,68.66 C14.A
+9V
  Top 0.254: C2.+ 73.28,30.99 73.36,31.06 | R17.1 56.46,39.24 60.45,35.26 64.52,35.26 65.63,34.14 74.19,34.14 74.75,33.58 74.75,32.74 75.06,32.44 75.06,32.18 75.21,32.03
  Top 2.54: U4.+ 93.75,69.04 93.24,68.53 93.24,32.89 92.38,32.03 76.78,32.03 | 76.78,32.03 75.21,32.03 74.93,32.03 73.97,31.06 | 73.97,31.06 73.89,30.99 73.89,26.75 IC1.1 | 73.36,31.06 73.97,31.06 | 9V1.2 75.92,14.78 77.09,15.95 77.09,31.73 76.78,32.03
ADC0  (via drill 0.6)
  Top 0.254: IC2.97 37.62,46.66 v39.17,48.31
  Bottom 0.254: v39.17,48.31 39.12,55.98 37.87,57.91 13.41,57.91 11.86,56.39 11.86,37.82 10.57,36.52 8.23,36.52 7.72,36.02 7.72,33.45 8.18,32.99 J1.7
ADC1  (via drill 0.6)
  Top 0.254: IC2.96 38.29,46.16 v38.68,45.77
  Bottom 0.254: v38.68,45.77 38.79,45.77 38.46,46.13 37.8,46.13 37.49,46.43 37.49,46.84 37.16,47.17 36.35,47.17 36.04,47.47 36.04,49.71 36.73,50.39 37.06,50.39 37.49,50.83 37.49,55.6 36.14,56.95 13.61,56.95 12.68,56.01 12.68,37.74 10.85,35.92 10.25,35.92 J1.8
ADC2  (via drill 0.6)
  Top 0.254: IC2.95 37.29,45.66 38.12,44.83 38.51,44.83 38.73,44.6 38.73,43.54 v38.66,43.46
  Bottom 0.254: v38.66,43.46 38.38,43.46 38.08,43.16 37.36,43.16 36.83,42.62 33.4,42.62 32.72,43.26 32.72,44.6 33.12,44.96 33.12,53.57 32.16,54.53 15.8,54.53 15.27,54 15.27,21.74 14.5,20.98 11.83,20.98 J1.9
ADC3  (via drill 0.6)
  Top 0.254: v33.6,43.79 33.6,44.42 34.31,45.14 35.48,45.14 IC2.94
  Bottom 0.254: J1.10 12.86,22.99 14.35,24.49 14.35,55.04 14.78,55.47 32.79,55.47 34.04,54.23 34.04,44.22 v33.6,43.79
ADC4  (via drill 0.6)
  Top 0.254: v37.29,44.12 37.29,44.5 36.85,44.68 35.52,44.68 IC2.93
  Bottom 0.254: J1.11 12.6,24.99 13.28,25.68 13.28,55.68 13.92,56.31 33.71,56.31 34.7,55.32 34.7,45.34 35.05,44.98 36.93,44.98 v37.29,44.12
D3
  Top 0.305: R28.1 D3.C
D4
  Top 0.305: D4.C R29.1
ETHCONECT
  Top 0.254: U9.18 41.59,63.26 44.02,60.83 53.57,60.83 54.74,59.66 ELINK1.C
GND  (via drill 0.6)
  Top 0.254: IC2.81 33.61,38.66 33.6,38.66 33.6,40.69 33.2,41.1 | C16.2 31.23,53.58 31.09,53.72 28.47,53.72 28.35,53.59 | 20.68,45.09 20.6,45.16 IC2.32 18.64,45.16 18.59,45.21 13.97,45.21 13.82,45.06 | IC2.99 36.84,47.66 36.96,47.78 36.96,48.21 v37.06,48.31 | IC2.11 28.51,51.3 28.17,51.64 27.64,51.69 v27.56,51.77 | IC2.62 27.01,33.18 26.42,32.59 | IC3.25 IC3.26 78.91,62.51 78.74,62.33 78.74,58.75 78.89,58.6 80.29,58.6 v80.49,58.4
  Top 0.61: OSS.2 15.75,39.45 16.31,39.55
  Bottom 0.254: 81.89,60.98 81.97,60.91 C12.2 81.94,60.84 81.94,58.5 81.84,58.4 v80.49,58.4 | v27.56,51.77 27.48,51.71 27.43,51.66 | C19.2 32.78,41.64 33.25,41.17 | 33.25,41.17 33.3,41.12 33.3,41.17 33.25,41.17 | 33.25,41.17 33.25,41.15 33.2,41.1
  other vias: 73.46,69.01 90.47,73.28 86.79,60.2 72.85,63.47 35.74,52.15 2.31,48.87 16.41,35.2 30.63,46.74 29.44,42.39 31.09,28.17 39.22,36.09 23.98,52.73 2.03,36.32 35.71,55.7 27.3,46.89 5.87,47.96 6.55,32.84 22.05,10.31 37.36,56.97 21.62,36.91 30.99,30.3 48.26,15.19 46.25,15.11 44.25,14.71 42.24,14.48 40.26,14.3 38.23,14.02 36.2,13.79
  pour Bottom: 0,82.55 131.8,82.42 131.8,-0.13 69.34,0.03 24.26,0.03 24.84,0.05 0,0
  pour Top: 0,82.55 131.78,82.47 131.78,-0.08 69.34,0 68.71,-0.03 24.21,0.08 24.89,0 0,0
IN1
  Top 0.254: U47.9 38.29,18.98 38.58,18.69 48.06,18.69 49.28,17.48 49.28,11.93 J4.9
IN2
  Top 0.254: U47.8 37.64,18.36 37.95,18.06 45.57,18.06 47.24,16.38 47.24,11.95 J4.10
IN3
  Top 0.254: U47.7 36.99,17.85 37.34,17.5 43.64,17.5 45.29,15.85 45.29,11.95 J4.11
IN4
  Top 0.254: U47.6 36.34,17.28 36.78,16.84 41.86,16.84 43.28,15.42 43.28,11.94 J4.12
IN5
  Top 0.254: U47.5 35.69,16.96 36.42,16.23 40.21,16.23 41.27,15.16 41.27,11.93 J4.13
IN6
  Top 0.254: U47.4 35.04,16.7 36.14,15.6 38.28,15.6 39.29,14.58 39.29,11.95 J4.14
IN7
  Top 0.254: U47.3 34.39,16.36 35.84,14.91 36.73,14.91 37.24,14.4 37.24,11.95 J4.15
IN8
  Top 0.254: U47.2 33.74,15.81 35.23,14.33 35.23,11.96 J4.16
MISO-1  (via drill 0.6)
  Top 0.254: IC2.22 23.01,49.02 22.71,48.72 22.71,46.86 v23.24,46.35 | v39.42,29.54 39.42,34.54 39.75,34.87 ICSP.1
  Bottom 0.254: v23.24,46.35 23.24,39.14 25.25,37.06 33.53,37.06 34.14,36.45 34.14,32.03 36.25,29.92 39.04,29.92 v39.42,29.54
MOSI-1  (via drill 0.6)
  Top 0.254: IC2.21 23.51,48.09 v24.13,47.47
  Bottom 0.254: v24.13,47.47 24.13,39.55 26.01,37.67 34.19,37.67 34.85,37.01 34.85,32.79 36.58,31.06 43.18,31.06 43.56,31.5 43.56,32.05 ICSP.4
N$1  (via drill 0.6)
  Top 0.254: v63.65,16.76 64.57,18.21 U5.8
  Bottom 0.254: C7.1 63.5,16.92 v63.65,16.76
N$2
  Top 0.254: 13.A 19.61,30.19 R3.1
N$3
  Bottom 0.406: R21.1 44.58,79.81 45.41,80.64 U$10.2 U$10.4
N$4
  Bottom 0.406: U$10.6 U$10.8 57.23,80.64 57.58,80.29 57.58,72.19 56.9,71.5 R22.1
N$5
  Top 0.406: X3.11 53.7,77.39 U$10.5
N$6
  Top 0.254: OSS.3 17.25,43.44 17.96,44.15 19.49,44.15 IC2.34
N$7
  Top 0.254: IC2.33 18.33,44.66 18.21,44.76 14.45,44.76 14.28,44.58 14.28,42.29 OSS.1
N$8
  Top 0.406: X3.9 56.24,77.39 U$10.7
N$9
  Top 0.406: R1.1 83.73,17.74 84.23,17.25 84.23,16.54 84.51,16.26 85.75,16.26 9V\2.A
N$10
  Top 0.254: J3.2 24.97,10.04 24.97,7.75 24.51,7.29 18.39,7.29 17.45,8.23 17.45,12.65 18.57,13.77 27.69,13.77 29.18,15.27 29.18,20.17 28.27,21.08 28.27,27.1 27.08,28.3 27.08,32.05 27.51,32.49 IC2.63
N$11
  Top 0.254: IC2.64 27.99,34.15 27.99,32.05 27.71,31.77 27.71,28.57 28.91,27.38 28.91,21.57 29.95,20.52 29.95,14.94 28.12,13.11 20.22,13.11 19.58,12.47 19.58,10.42 J3.3
N$12  (via drill 0.6)
  Top 0.254: v17.2,36.6 17.2,37.41 17.42,37.64 19.49,37.64 IC2.47
  Bottom 0.254: v17.2,36.6 18.31,35.48 18.31,32.66 19.28,31.7 23.44,31.7 24.08,31.06 24.08,23.75 ABLIGHT.1
N$13
  Top 0.254: JP2.1 19.23,17.42 18.26,18.39 18.26,34.39 19.48,35.61 19.48,36.14 IC2.50
N$14
  Top 0.254: JP2.2 24.28,16.28 23.24,15.24 18.75,15.24 17.3,16.69 17.3,34.59 18.34,35.64 18.34,36.58 18.44,36.68 19.5,36.68 IC2.49
N$15
  Top 0.254: U9.25 7.07,55.23 8.66,56.82 22.3,56.82 27.15,61.67 JP3.1
N$16
  Top 0.254: U9.21 20.08,59.24 23.47,62.64 23.47,73.79 24.61,74.93 JP3.2
N$22
  Top 0.254: 9V\1.A R17.2
N$23
  Top 0.254: 3.3V.A 52.41,30.84 R16.2
N$24
  Top 0.254: 5V.A 52.47,35.46 R15.2
N$25
  Bottom 2.54: U4.ACL 155.57,76.4 156.41,75.56 156.44,75.56 157.05,74.95 157.05,74.91 157.63,74.32 157.63,59.51 156.77,58.65 J10.2 151.74,58.65 148.62,55.52 148.62,42.14 150.7,40.06 154.69,40.06 U3.L
N$27
  Bottom 2.54: J10.1 148.31,63.73 145.77,61.19 145.77,58.93 U4.ACN 144.12,58.85 143.03,57.76 143.03,25.07 146.1,22 U3.N
N$28
  Top 0.406: C1.+ 81.51,21.36 81.97,20.9 R1.2
  Top 2.184: 9V2.1 91.44,26.19 91.24,26.39
  Top 2.54: U3.V+ 100.1,29.36 97.13,26.39 91.24,26.39 90.93,26.39 | 90.93,26.39 81.36,26.39 81.23,26.26 81.43,26.26 C1.+ | 91.44,25.88 90.93,26.39
N$29
  Top 0.254: CN2.D+ 84.15,73.15 JP4.2 83.21,70.28 82.58,69.66 IC3.15
N$30
  Top 0.254: CN2.D- 84.95,73.27 JP4.3 85.78,72.44 85.78,69.8 84.98,69 IC3.16
N$31
  Top 0.254: IC3.23 81.85,64.45 82.17,64.14 82.17,56.92 82.63,56.46 83.43,56.46 TX1.C
N$32
  Top 0.254: RX1.C 83.48,64.53 82.93,65.08 80.73,65.08 IC3.22
N$33
  Top 0.254: RX1.A R18.2
N$34
  Top 0.254: TX1.A R19.2
N$35  (via drill 0.6)
  Top 0.406: v89.23,60.43 88.16,60.43 87.91,60.66 87.91,61.17 IC3.1
  Bottom 0.406: R20.2 91.21,60.22 90.73,60.71 89.51,60.71 v89.23,60.43
N$36  (via drill 0.6)
  Top 0.254: IC3.17 79.4,68.36 v78.87,68.89 | v84.96,62.76 85.24,62.76 85.65,63.17 87.86,63.17 IC3.4
  Bottom 0.254: v78.87,68.89 80.97,68.89 81.66,68.2 81.66,64.24 82.75,63.14 84.58,63.14 v84.96,62.76 84.94,62.74 84.94,61.37 84.48,60.91 C12.1
N$37
  Top 0.254: U9.8 44.49,73.29 45.06,72.72 45.06,64.82 46.05,63.83 49.12,63.83 49.89,64.59 X3.3
N$38
  Top 0.254: X3.1 46.5,66.7 46.08,67.13 46.08,74.24 44.98,75.34 40.37,75.34 U9.6
N$39
  Top 0.254: U9.14 43.45,67.27 43.81,66.9 43.81,64.29 45.31,62.79 52.4,62.79 53.7,64.08 X3.6
N$42
  Top 0.254: U9.16 42.05,65.27 42.88,64.44 42.88,63.58 44.55,61.9 54.36,61.9 56.26,63.8 56.26,66.68 X3.8
N$44  (via drill 0.6)
  Top 0.254: v55.02,64.47 55.02,66.65 X3.7
  Bottom 0.254: U9.12 41.26,69.28 42.11,68.61 46.3,68.61 46.79,68.12 46.79,64.16 47.22,63.73 54.28,63.73 v55.02,64.47
N$45  (via drill 0.6)
  Top 0.254: v47.8,65.1 48.11,65.1 48.64,65.63 48.64,66.68 X3.2
  Bottom 0.254: U9.10 41.11,71.28 41.66,70.74 41.66,70.05 42.47,69.39 47.52,69.39 48.64,68.12 48.64,65.43 48.39,65.18 47.83,65.18 v47.8,65.1
N$50
  Top 0.406: X3.14 49.89,77.55 U$10.3
N$51
  Top 0.406: X3.16 47.35,77.55 U$10.1
N$52  (via drill 0.6)
  Top 0.406: X3.15 48.62,71.6 v48.51,71.5 54.53,71.5 54.97,71.93 X3.10
  Bottom 0.406: R22.2 49.02,71.5 v48.51,71.5 44.83,71.5 44.72,71.39 | 44.72,71.39 44.42,71.09 44.23,71.09 C13.2 | R21.2 44.58,71.53 44.72,71.39
N$69
  Top 0.254: R27.2 54.69,55.17 54.97,55.45 54.91,55.45 ELINK1.A
N$71
  Top 0.254: R24.2 51.16,55.49 EACT1.A
N$72
  Top 0.254: R23.2 WIFI1.A
N$73
  Top 0.254: U9.20 41.9,61.25 44.09,59.05 50.44,59.05 51.21,58.29 51.21,57.64 EACT1.C
N$74
  Top 0.305: D3.A 69.98,36.91 70.21,37.13 70.21,39.85 70.41,40.06 U10.21
N$75
  Top 0.305: D4.A 67.62,39.76 68,40.13 68,41.31 U10.19
O1
  Top 0.254: U47.12 38.29,31.61 37.72,32.18 37.72,36.35 36.91,37.16 IC2.78
O2
  Top 0.254: U47.13 37.64,31.34 37.06,31.93 37.06,36.17 36.58,36.65 IC2.77
O3
  Top 0.254: U47.14 36.99,30.62 35.51,32.11 IC2.76
O4
  Top 0.254: IC2.75 33.51,32.79 36.32,29.97 36.32,27.42 U47.15
O5
  Top 0.254: IC2.74 33.01,32.5 35.69,29.82 U47.16
O6
  Top 0.254: IC2.73 32.51,32.21 35.03,29.69 35.03,27.41 U47.17
O7
  Top 0.254: IC2.72 32.01,31.97 34.42,29.57 34.42,27.42 U47.18
O8
  Top 0.254: IC2.71 31.51,31.74 33.73,29.52 U47.19
PIO4
  Top 0.254: R30.2 71.78,41.16 U10.22
PN13  (via drill 0.6)
  Top 0.254: v20.04,49.94 20.04,49.45 19.51,48.92 IC2.26 | R3.2 19.56,33.35 v20.37,34.16
  Bottom 0.254: v20.04,49.94 21.36,48.54 21.39,48.51 21.39,47.47 20.37,46.46 v20.37,34.16
RX2
  Top 0.254: IC2.13 27.51,48.72 28.07,48.16 33.93,48.16 35.18,49.4 38.41,49.4 39.22,50.22 42.77,50.22 43.28,49.68 43.28,44.58 45.09,42.77 51.94,42.77 JP1.3 54.61,42.75 56.72,40.64 58.75,40.64 59.51,39.88 60.53,39.88 60.81,40.16 U10.13
RXD0  (via drill 0.6)
  Top 0.254: 89.38,63.8 IC3.5 | IC3.5 | IC2.3 32.51,53.92 33.1,54.51 38.51,54.51 38.86,54.86 38.86,55.85 39.24,56.24 44.15,56.24 v44.35,56.06
  Top 0.406: v89.69,62.69 89.69,63.5 89.38,63.8
  Bottom 0.254: v44.35,56.06 88.32,56.06 88.39,56.13
  Bottom 0.406: JP7.1 88.39,56.13 88.39,59.36 88.09,59.66 88.09,62.13 88.44,62.48 89.48,62.48 v89.69,62.69
RXD1  (via drill 0.6)
  Top 0.254: v10.77,40.84 10.77,40.62 11.79,39.6 12.12,39.6 13.03,38.68 19.49,38.68 IC2.45
  Bottom 0.254: U9.5 6.62,75.3 8.59,73.33 8.59,47.04 9.45,46.18 10.16,46.18 10.87,45.47 10.87,40.95 v10.77,40.84
SCK-1  (via drill 0.6)
  Top 0.254: IC2.20 24.01,48.97 24.64,48.34 25.12,48.34 v25.38,48.08
  Bottom 0.254: v25.38,48.08 25.38,39.37 26.09,38.66 34.62,38.66 35.81,37.47 35.81,33.43 36.93,32.31 41.27,32.31 ICSP.3
TX2
  Top 0.254: IC2.12 27.99,50.15 27.99,49.02 28.19,48.82 33.81,48.82 35.18,50.19 37.77,50.19 38.41,50.83 38.41,51.74 38.89,52.22 43,52.22 43.92,51.28 43.92,46.51 45.14,45.29 JP1.2 53.06,45.29 53.8,44.55 53.8,43.87 54.23,43.43 54.99,43.43 57.05,41.38 59.49,41.38 59.66,41.55 59.66,42.09 60.33,42.75 61.77,42.75 62.03,42.49 62.03,41.34 U10.14
TXD0  (via drill 0.6)
  Top 0.254: IC2.2 33.01,53.48 33.48,53.95 39.24,53.95 39.5,54.23 44.09,54.23 v44.65,54.05
  Bottom 0.254: v44.65,54.05 74.22,54.03 75.06,54.86 84.56,54.86 85.98,53.44 85.98,50.04 86.21,49.81 JP7.2
  Bottom 0.406: R20.1 91.21,50.42 90.6,49.81 JP7.2
TXD1  (via drill 0.6)
  Top 0.254: v10.11,38.89 10.87,38.89 11.61,38.15 19.5,38.15 IC2.46
  Bottom 0.254: U9.9 6.21,71.28 7.21,70.28 7.21,46.08 8.36,44.93 9.2,44.93 9.73,44.4 9.73,39.27 v10.11,38.89
WIFICONECT
  Top 0.254: U9.22 42.3,59.24 43.89,57.66 47.52,57.66 WIFI1.C
XAXIS1  (via drill 0.6)
  Top 0.254: IC2.87 37.73,41.66 v38.18,42.11
  Bottom 0.254: v38.18,42.11 38.18,40.49 38.71,39.95 41.22,39.95 41.38,40.11 41.38,59.41 41.76,59.79 69.19,59.79 70.41,61.01 70.41,63.98 J2.3
XAXIS2  (via drill 0.6)
  Top 0.254: IC2.85 37.42,40.66 38.94,39.14 38.94,38.89 v39.14,38.68
  Bottom 0.254: v39.14,38.68 39.14,38.61 39.95,37.8 42.01,37.8 42.67,38.46 42.67,57.96 43.23,58.52 75.29,58.52 77.04,60.27 77.04,66.34 76.4,66.98 71.04,66.98 70.35,67.67 J5.3
YAXIS1  (via drill 0.6)
  Top 0.254: IC2.86 37.8,41.16 39.29,39.67 40.41,39.67 40.62,39.47 40.62,39.04 v40.84,38.81
  Bottom 0.254: v40.84,38.81 41.25,38.81 41.33,38.89 41.71,38.89 42.01,39.19 42.01,58.67 42.44,59.11 73.53,59.11 75.46,61.04 J2.4
YAXIS2  (via drill 0.6)
  Top 0.254: IC2.84 36.77,40.16 37.16,39.78 37.16,38.99 v37.57,38.58
  Bottom 0.254: v37.57,38.58 37.82,38.58 39.27,37.13 42.37,37.13 43.2,37.97 43.2,57.25 43.79,57.84 75.64,57.84 77.55,59.74 77.55,66.65 76.61,67.59 75.77,67.59 75.35,68.01 J5.4

### Text on the board
tPlace: RJ | 1
_tsilk: U$10 | 1 | J5 | IC3 | J2 | J10 | 1 | RX1 | + | R18 | U10 | TX1 | WIFI1 | EACT1 | ELINK1 | + | R19 | C16 | + | + | + | JP7 | IC2 | R23 | R24 | R27 | C20 | U3 | C17 | C1 | U4 | RJ | R29 | D4 | OSS | U9 | 9V\1 | R17 | + | D3 | R30 | R28 | + | 1 | 5V | R15 | C5 | C2 | + | R3 | R16 | 3.3V | 13 | ICSP | U47 | U5 | 1 | C30 | C6 | J1 | J4 | IC1 | R1 | 9V\2 | R2 | J3 | S1 | 1 | 1 | 1 | 1 | 1 | 3.3V1 | 5V1 | 9V1 | 9V2
_bsilk: R21 | R22 | C13 | C11 | C14 | C12 | R20 | C3 | C8 | C19 | C4 | C18 | C7